# EAGLE design 310_usb_memory (EAGLE 7.4.0)
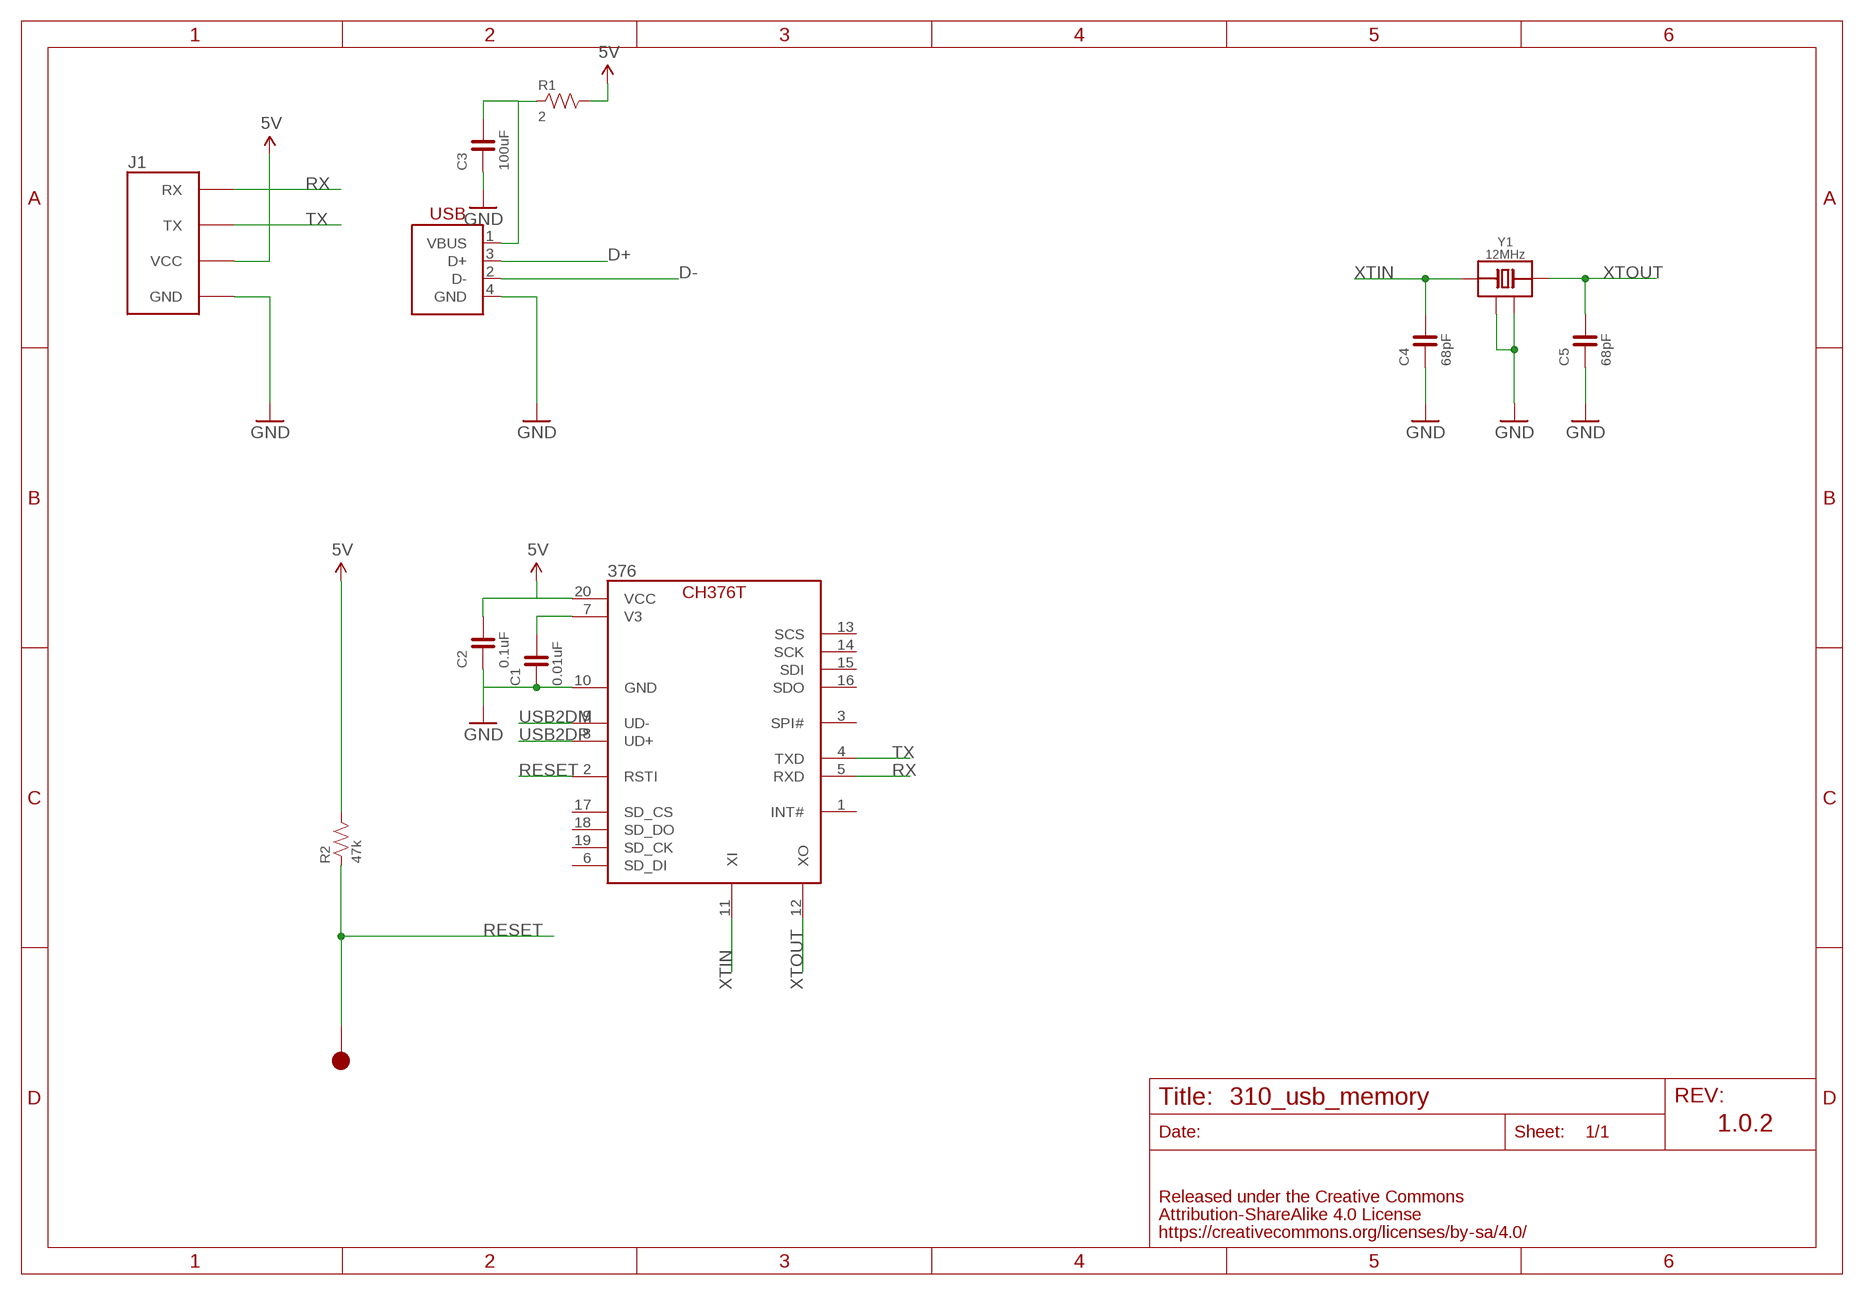
[diagram p0: schematic, sheet 1]

## Parts
376  CH376T  [SSOP-20]
C1  0.01uF  CAPACITOR-0402  [0402]
C2  0.1uF  CAPACITOR-0402  [0402]
C3  100uF  CAPACITOR-0402  [0402]
C4  68pF  CAPACITOR-0402  [0402]
C5  68pF  CAPACITOR-0402  [0402]
J1  FABO_BRICK_SERIAL  [FABO_BRICK_SERIAL]
R1  2  RESISTOR-0402  [0402]
R2  47k  RESISTOR-0402  [0402]
TP1  TP-15  [TP-15]
USB1  USB-B_PTH  [USB-4AF103BS]
Y1  12MHz  CRYSTAL-ECS-120-12-33Q  [ECS-12MHZ]

## Nets
5V: 376.20(VCC) C2.P$2 J1.VCC R1.P$2 R2.P$2
D+: USB1.3(D+)
D-: USB1.2(D-)
GND: 376.10(GND) C1.P$1 C2.P$1 C3.P$1 C4.P$1 C5.P$1 J1.GND USB1.4(GND) Y1.2(GND) Y1.4(GND)
N$1: 376.7(V3) C1.P$2
N$3: C3.P$2 R1.P$1 USB1.1(VBUS)
RESET: 376.2(RSTI) R2.P$1 TP1.1
RX: 376.5(RXD) J1.RX
TX: 376.4(TXD) J1.TX
USB2DM: 376.9(UD-)
USB2DP: 376.8(UD+)
XTIN: 376.11(XI) C4.P$2 Y1.1(IO)
XTOUT: 376.12(XO) C5.P$2 Y1.3(IO)
Unconnected: 376.1(INT#) 376.3(SPI#) 376.6(SD_DI) 376.13(SCS) 376.14(SCK) 376.15(SDI) 376.16(SDO) 376.17(SD_CS) 376.18(SD_DO) 376.19(SD_CK)

## Notes on the sheet
- 1.0.2

## Library data of the parts
376 = FaBo-USB:CH376T
C1-C5 = FaBo-Capacitor:CAPACITOR: CAPACITOR
J1 = FaBo-Template:FABO_BRICK_SERIAL: FaBo Brick Serial
R1 R2 = FaBo-Resistors:RESISTOR: RESISTOR
TP1 = FaBo-Supply:TP
USB1 = FaBo-USB:USB
Y1 = FaBo-Crystal:CRYSTAL-ECS

## Board
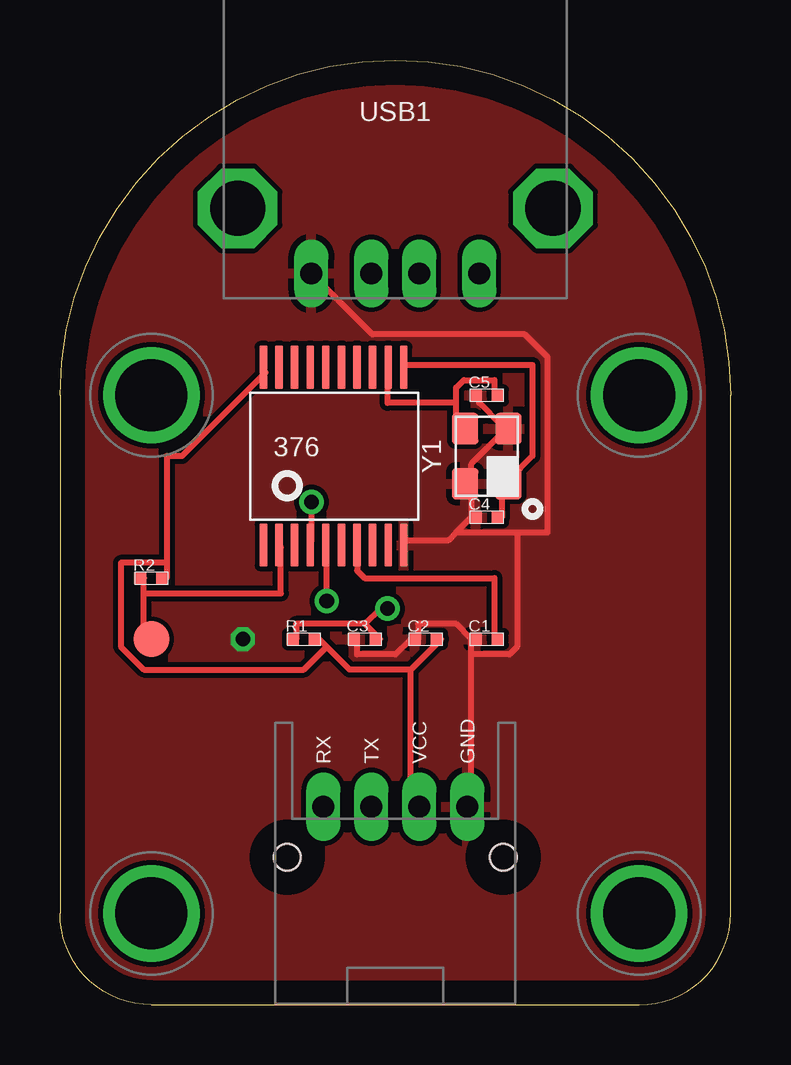
[diagram p1: board, top side]
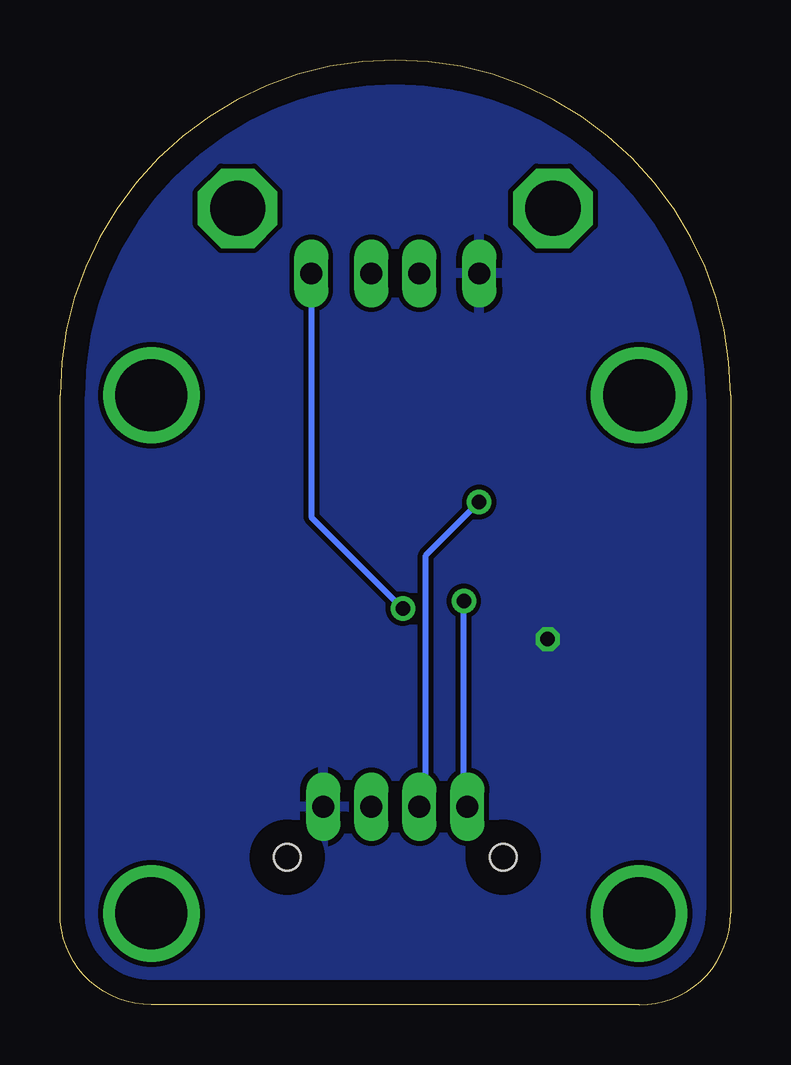
[diagram p2: board, bottom side, seen from below]

Size 27.94 x 39.37 mm. Coordinates in mm from the lower left corner, seen from the top.
Copper layers (1*16): Top 0.035mm / dielectric 1.5mm / Bottom 0.035mm
Design rules "default": minimum track width 10mil, minimum drill 24mil, track to track 8mil, track to pad 8mil, pad to pad 8mil, via to via 8mil, smd to smd 8mil, copper to edge 40mil, drill to drill 8mil, minimum pad ring 10mil, minimum via ring 8mil, stop-mask expansion 4mil, vias tented up to drill 0mil, thermal gap 10mil

### Footprints (pad centres in the part's own frame; a part is rotated, then mirrored left to right if it is on the bottom)
SSOP-20 = smd 0.32 x 1.8: 1 -2.955,-3.7; 2 -2.305,-3.7; 3 -1.655,-3.7; 4 -1.005,-3.7; 5 -0.355,-3.7; 6 0.295,-3.7; 7 0.945,-3.7; 8 1.595,-3.7; 9 2.245,-3.7; 10 2.895,-3.7; 11 2.895,3.7; 12 2.245,3.7; 13 1.595,3.7; 14 0.945,3.7; 15 0.295,3.7; 16 -0.355,3.7; 17 -1.005,3.7; 18 -1.655,3.7; 19 -2.305,3.7; 20 -2.955,3.7
0402 = smd 0.5 x 0.5: P$1 -0.46,0; P$2 0.46,0
FABO_BRICK_SERIAL = drill 0.9 pad 1.422 long: GND 3,-10.795; RX -3,-10.795; TX -1,-10.795; VCC 1,-10.795 | drill 3 pad 3.81: P$1 -10.16,6.35; P$2 10.16,6.35; P$3 -10.16,-15.24; P$4 10.16,-15.24 | hole 1.1: -4.5,-12.895; 4.5,-12.895
TP-15 = smd 1.5 x 1.5: 1 0,0
USB-4AF103BS = drill 0.9 long: 1 3.5,0; 2 1,0; 3 -1,0; 4 -3.5,0 | drill 2.3 octagon: P$1 -6.57,2.71; P$2 6.57,2.71
ECS-12MHZ = smd 1.3 x 1.1: 1 -1.15,-0.9; 2 1.15,-0.9; 3 1.15,0.9; 4 -1.15,0.9

### Placement (x,y rotation side)
376  11.43,22.86 0 top
C1  17.78,15.24 0 top
C2  15.24,15.24 0 top
C3  12.7,15.24 0 top
C4  17.78,20.32 0 top
C5  17.78,25.4 0 top
J1  13.97,19.05 0 top
R1  10.16,15.24 0 top
R2  3.81,17.78 0 top
TP1  3.81,15.24 0 top
USB1  13.97,30.48 0 top
Y1  17.78,22.86 90 top

### Tracks (layer width: path | path; a pad name or v marks a point on that pad's centre or on a via)
5V
  Top 0.254: 11.11,14.92 12.06,13.97 14.61,13.97 | 11.11,14.92 10.79,15.24 R1.P$2 | 14.61,13.97 15.88,15.24 C2.P$2 | 14.61,13.97 14.61,8.26 J1.VCC | 4.45,18.41 4.45,22.86 5.08,22.86 8.57,26.35 376.20 | 4.45,18.41 4.45,17.78 R2.P$2 | 11.11,14.92 10.16,13.97 3.49,13.97 2.54,14.92 2.54,18.41 4.45,18.41
GND  (via drill 0.6)
  Top 0.254: C3.P$1 12.38,15.24 12.38,14.61 13.97,14.61 14.61,15.24 C2.P$1 14.92,15.24 14.92,15.88 16.51,15.88 17.14,15.24 | 17.14,14.61 17.14,8.26 J1.GND | 17.14,14.61 17.14,15.24 | 17.14,15.24 C1.P$1 | C5.P$1 17.46,25.4 17.46,25.08 18.41,24.13 Y1.2 18.41,23.81 17.14,22.54 17.14,21.91 Y1.4 17.14,21.59 17.14,20.32 | 16.51,19.68 16.19,19.37 14.29,19.37 376.10 | 16.51,19.68 17.14,20.32 | 17.14,20.32 C4.P$1 | 16.51,19.68 19.05,19.68 | 19.05,19.68 20.32,19.68 20.32,26.99 19.37,27.94 13.02,27.94 USB1.4 | 17.14,14.61 18.73,14.61 19.05,14.92 19.05,19.68
  other vias: 7.62,15.24
  pour Top: 0,0 27.94,0 27.94,40.64 0,40.64
  pour Bottom: 0,0 27.94,0 27.94,40.64 0,40.64
N$1
  Top 0.254: C1.P$2 18.1,15.24 18.1,17.78 12.7,17.78 12.38,18.1 12.38,19.05 376.7
N$3  (via drill 0.61)
  Top 0.254: 12.7,15.88 9.84,15.88 9.84,15.24 R1.P$1 | 12.7,15.88 13.34,15.24 C3.P$2 | 12.7,15.88 13.34,16.51 v13.65,16.51
  Bottom 0.254: v13.65,16.51 17.46,20.32 USB1.1
RESET
  Top 0.254: 3.49,17.14 3.49,15.24 TP1.1 | 3.49,17.14 3.49,17.78 R2.P$1 | 3.49,17.14 9.21,17.14 9.21,19.05 376.2
RX  (via drill 0.61)
  Top 0.254: v11.11,16.83 11.11,19.05 376.5
  Bottom 0.254: v11.11,16.83 11.11,8.26 J1.RX
TX  (via drill 0.61)
  Top 0.254: v10.48,20.95 10.48,19.37 376.4
  Bottom 0.254: v10.48,20.95 12.7,18.73 12.7,8.26 J1.TX
XTIN
  Top 0.254: C4.P$2 18.41,20.32 18.41,21.59 Y1.1 18.73,21.91 19.68,22.86 19.68,26.67 14.29,26.67 376.11
XTOUT
  Top 0.254: 16.51,25.08 16.51,24.13 16.83,24.13 Y1.3 | 16.51,25.08 16.51,25.72 16.83,26.04 18.1,26.04 18.1,25.4 C5.P$2 | 16.51,25.08 13.65,25.08 13.65,26.35 376.12